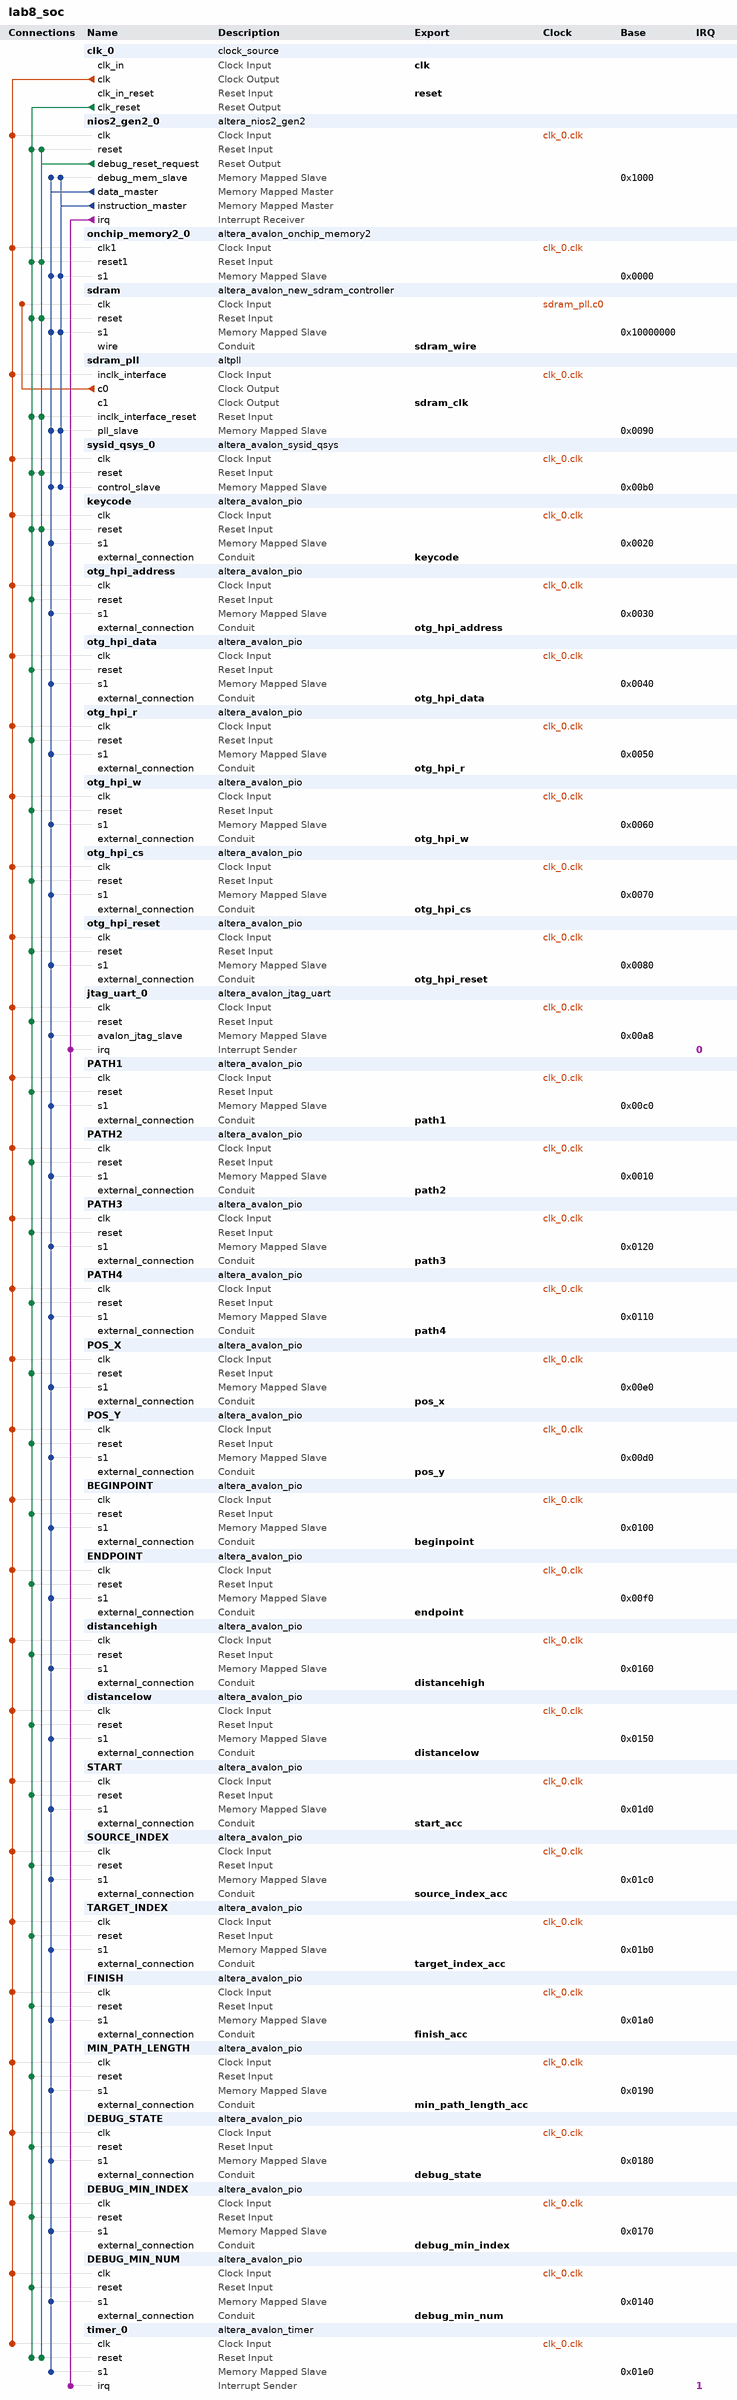
[diagram p0: system contents]
# Platform Designer (Qsys) system lab8_soc, Cyclone IV E EP4CE115F29C7
# Parameters at their usual value, and those the tool derives, are not listed.
package require -exact qsys 18.1
create_system lab8_soc
set_project_property DEVICE_FAMILY {Cyclone IV E}
set_project_property DEVICE EP4CE115F29C7

add_instance clk_0 clock_source 18.1
set_instance_parameter_value clk_0 clockFrequency 50000000

add_instance nios2_gen2_0 altera_nios2_gen2 18.1
set_instance_parameter_value nios2_gen2_0 dcache_size 2048
set_instance_parameter_value nios2_gen2_0 exceptionSlave sdram.s1
set_instance_parameter_value nios2_gen2_0 icache_size 4096
set_instance_parameter_value nios2_gen2_0 impl Tiny
set_instance_parameter_value nios2_gen2_0 resetSlave sdram.s1

add_instance onchip_memory2_0 altera_avalon_onchip_memory2 18.1
set_instance_parameter_value onchip_memory2_0 dataWidth 32
set_instance_parameter_value onchip_memory2_0 dualPort false
set_instance_parameter_value onchip_memory2_0 initMemContent true
set_instance_parameter_value onchip_memory2_0 initializationFileName onchip_mem.hex
set_instance_parameter_value onchip_memory2_0 memorySize 16

add_instance sdram altera_avalon_new_sdram_controller 18.1
set_instance_parameter_value sdram TAC 5.5
set_instance_parameter_value sdram TRCD 20.0
set_instance_parameter_value sdram TRP 20.0
set_instance_parameter_value sdram casLatency 3
set_instance_parameter_value sdram columnWidth 10
set_instance_parameter_value sdram dataWidth 32
set_instance_parameter_value sdram generateSimulationModel false
set_instance_parameter_value sdram model single_Micron_MT48LC4M32B2_7_chip
set_instance_parameter_value sdram numberOfBanks 4
set_instance_parameter_value sdram numberOfChipSelects 1
set_instance_parameter_value sdram powerUpDelay 200.0
set_instance_parameter_value sdram refreshPeriod 7.8125
set_instance_parameter_value sdram rowWidth 13

add_instance sdram_pll altpll 18.1
set_instance_parameter_value sdram_pll CLK0_DIVIDE_BY 1
set_instance_parameter_value sdram_pll CLK0_MULTIPLY_BY 1
set_instance_parameter_value sdram_pll CLK1_DIVIDE_BY 1
set_instance_parameter_value sdram_pll CLK1_DUTY_CYCLE 50
set_instance_parameter_value sdram_pll CLK1_MULTIPLY_BY 1
set_instance_parameter_value sdram_pll CLK1_PHASE_SHIFT -3000
set_instance_parameter_value sdram_pll INCLK0_INPUT_FREQUENCY 20000
set_instance_parameter_value sdram_pll PORT_ARESET PORT_UNUSED
set_instance_parameter_value sdram_pll PORT_LOCKED PORT_UNUSED
set_instance_parameter_value sdram_pll PORT_clk1 PORT_USED
set_instance_parameter_value sdram_pll PORT_clk2 PORT_UNUSED
set_instance_parameter_value sdram_pll PORT_clk3 PORT_UNUSED

add_instance sysid_qsys_0 altera_avalon_sysid_qsys 18.1
set_instance_parameter_value sysid_qsys_0 id 0

add_instance keycode altera_avalon_pio 18.1
set_instance_parameter_value keycode direction Output
set_instance_parameter_value keycode width 8

add_instance otg_hpi_address altera_avalon_pio 18.1
set_instance_parameter_value otg_hpi_address direction Output
set_instance_parameter_value otg_hpi_address width 2

add_instance otg_hpi_data altera_avalon_pio 18.1
set_instance_parameter_value otg_hpi_data direction InOut
set_instance_parameter_value otg_hpi_data width 16

add_instance otg_hpi_r altera_avalon_pio 18.1
set_instance_parameter_value otg_hpi_r direction Output
set_instance_parameter_value otg_hpi_r width 1

add_instance otg_hpi_w altera_avalon_pio 18.1
set_instance_parameter_value otg_hpi_w direction Output
set_instance_parameter_value otg_hpi_w width 1

add_instance otg_hpi_cs altera_avalon_pio 18.1
set_instance_parameter_value otg_hpi_cs direction Output
set_instance_parameter_value otg_hpi_cs width 1

add_instance otg_hpi_reset altera_avalon_pio 18.1
set_instance_parameter_value otg_hpi_reset direction Output
set_instance_parameter_value otg_hpi_reset width 1

add_instance jtag_uart_0 altera_avalon_jtag_uart 18.1
set_instance_parameter_value jtag_uart_0 simInteractiveOptions NO_INTERACTIVE_WINDOWS

add_instance PATH1 altera_avalon_pio 18.1
set_instance_parameter_value PATH1 direction Output
set_instance_parameter_value PATH1 width 32

add_instance PATH2 altera_avalon_pio 18.1
set_instance_parameter_value PATH2 direction Output
set_instance_parameter_value PATH2 width 32

add_instance PATH3 altera_avalon_pio 18.1
set_instance_parameter_value PATH3 direction Output
set_instance_parameter_value PATH3 width 32

add_instance PATH4 altera_avalon_pio 18.1
set_instance_parameter_value PATH4 direction Output
set_instance_parameter_value PATH4 width 32

add_instance POS_X altera_avalon_pio 18.1
set_instance_parameter_value POS_X direction Input
set_instance_parameter_value POS_X width 10

add_instance POS_Y altera_avalon_pio 18.1
set_instance_parameter_value POS_Y direction Input
set_instance_parameter_value POS_Y width 10

add_instance BEGINPOINT altera_avalon_pio 18.1
set_instance_parameter_value BEGINPOINT direction Output
set_instance_parameter_value BEGINPOINT width 32

add_instance ENDPOINT altera_avalon_pio 18.1
set_instance_parameter_value ENDPOINT direction Output
set_instance_parameter_value ENDPOINT width 32

add_instance distancehigh altera_avalon_pio 18.1
set_instance_parameter_value distancehigh direction Output
set_instance_parameter_value distancehigh width 32

add_instance distancelow altera_avalon_pio 18.1
set_instance_parameter_value distancelow direction Output
set_instance_parameter_value distancelow width 32

add_instance START altera_avalon_pio 18.1
set_instance_parameter_value START direction Output
set_instance_parameter_value START width 1

add_instance SOURCE_INDEX altera_avalon_pio 18.1
set_instance_parameter_value SOURCE_INDEX direction Output
set_instance_parameter_value SOURCE_INDEX width 8

add_instance TARGET_INDEX altera_avalon_pio 18.1
set_instance_parameter_value TARGET_INDEX direction Output
set_instance_parameter_value TARGET_INDEX width 8

add_instance FINISH altera_avalon_pio 18.1
set_instance_parameter_value FINISH direction Input
set_instance_parameter_value FINISH width 1

add_instance MIN_PATH_LENGTH altera_avalon_pio 18.1
set_instance_parameter_value MIN_PATH_LENGTH direction Input
set_instance_parameter_value MIN_PATH_LENGTH width 16

add_instance DEBUG_STATE altera_avalon_pio 18.1
set_instance_parameter_value DEBUG_STATE direction Input
set_instance_parameter_value DEBUG_STATE width 3

add_instance DEBUG_MIN_INDEX altera_avalon_pio 18.1
set_instance_parameter_value DEBUG_MIN_INDEX direction Input
set_instance_parameter_value DEBUG_MIN_INDEX width 7

add_instance DEBUG_MIN_NUM altera_avalon_pio 18.1
set_instance_parameter_value DEBUG_MIN_NUM direction Input
set_instance_parameter_value DEBUG_MIN_NUM width 16

add_instance timer_0 altera_avalon_timer 18.1
set_instance_parameter_value timer_0 period 1
set_instance_parameter_value timer_0 periodUnits MSEC

# connections
add_connection clk_0.clk BEGINPOINT.clk clock
add_connection clk_0.clk DEBUG_MIN_INDEX.clk clock
add_connection clk_0.clk DEBUG_MIN_NUM.clk clock
add_connection clk_0.clk DEBUG_STATE.clk clock
add_connection clk_0.clk distancehigh.clk clock
add_connection clk_0.clk distancelow.clk clock
add_connection clk_0.clk ENDPOINT.clk clock
add_connection clk_0.clk FINISH.clk clock
add_connection clk_0.clk jtag_uart_0.clk clock
add_connection clk_0.clk keycode.clk clock
add_connection clk_0.clk MIN_PATH_LENGTH.clk clock
add_connection clk_0.clk nios2_gen2_0.clk clock
add_connection clk_0.clk onchip_memory2_0.clk1 clock
add_connection clk_0.clk otg_hpi_address.clk clock
add_connection clk_0.clk otg_hpi_cs.clk clock
add_connection clk_0.clk otg_hpi_data.clk clock
add_connection clk_0.clk otg_hpi_r.clk clock
add_connection clk_0.clk otg_hpi_reset.clk clock
add_connection clk_0.clk otg_hpi_w.clk clock
add_connection clk_0.clk PATH1.clk clock
add_connection clk_0.clk PATH2.clk clock
add_connection clk_0.clk PATH3.clk clock
add_connection clk_0.clk PATH4.clk clock
add_connection clk_0.clk POS_X.clk clock
add_connection clk_0.clk POS_Y.clk clock
add_connection clk_0.clk sdram_pll.inclk_interface clock
add_connection clk_0.clk SOURCE_INDEX.clk clock
add_connection clk_0.clk START.clk clock
add_connection clk_0.clk sysid_qsys_0.clk clock
add_connection clk_0.clk TARGET_INDEX.clk clock
add_connection clk_0.clk timer_0.clk clock
add_connection sdram_pll.c0 sdram.clk clock
add_connection clk_0.clk_reset BEGINPOINT.reset reset
add_connection clk_0.clk_reset DEBUG_MIN_INDEX.reset reset
add_connection clk_0.clk_reset DEBUG_MIN_NUM.reset reset
add_connection clk_0.clk_reset DEBUG_STATE.reset reset
add_connection clk_0.clk_reset distancehigh.reset reset
add_connection clk_0.clk_reset distancelow.reset reset
add_connection clk_0.clk_reset ENDPOINT.reset reset
add_connection clk_0.clk_reset FINISH.reset reset
add_connection clk_0.clk_reset jtag_uart_0.reset reset
add_connection clk_0.clk_reset keycode.reset reset
add_connection clk_0.clk_reset MIN_PATH_LENGTH.reset reset
add_connection clk_0.clk_reset nios2_gen2_0.reset reset
add_connection clk_0.clk_reset onchip_memory2_0.reset1 reset
add_connection clk_0.clk_reset otg_hpi_address.reset reset
add_connection clk_0.clk_reset otg_hpi_cs.reset reset
add_connection clk_0.clk_reset otg_hpi_data.reset reset
add_connection clk_0.clk_reset otg_hpi_r.reset reset
add_connection clk_0.clk_reset otg_hpi_reset.reset reset
add_connection clk_0.clk_reset otg_hpi_w.reset reset
add_connection clk_0.clk_reset PATH1.reset reset
add_connection clk_0.clk_reset PATH2.reset reset
add_connection clk_0.clk_reset PATH3.reset reset
add_connection clk_0.clk_reset PATH4.reset reset
add_connection clk_0.clk_reset POS_X.reset reset
add_connection clk_0.clk_reset POS_Y.reset reset
add_connection clk_0.clk_reset sdram.reset reset
add_connection clk_0.clk_reset sdram_pll.inclk_interface_reset reset
add_connection clk_0.clk_reset SOURCE_INDEX.reset reset
add_connection clk_0.clk_reset START.reset reset
add_connection clk_0.clk_reset sysid_qsys_0.reset reset
add_connection clk_0.clk_reset TARGET_INDEX.reset reset
add_connection clk_0.clk_reset timer_0.reset reset
add_connection nios2_gen2_0.debug_reset_request keycode.reset reset
add_connection nios2_gen2_0.debug_reset_request nios2_gen2_0.reset reset
add_connection nios2_gen2_0.debug_reset_request onchip_memory2_0.reset1 reset
add_connection nios2_gen2_0.debug_reset_request sdram.reset reset
add_connection nios2_gen2_0.debug_reset_request sdram_pll.inclk_interface_reset reset
add_connection nios2_gen2_0.debug_reset_request sysid_qsys_0.reset reset
add_connection nios2_gen2_0.debug_reset_request timer_0.reset reset
add_connection nios2_gen2_0.data_master BEGINPOINT.s1 avalon
set_connection_parameter_value nios2_gen2_0.data_master/BEGINPOINT.s1 baseAddress 0x0100
add_connection nios2_gen2_0.data_master DEBUG_MIN_INDEX.s1 avalon
set_connection_parameter_value nios2_gen2_0.data_master/DEBUG_MIN_INDEX.s1 baseAddress 0x0170
add_connection nios2_gen2_0.data_master DEBUG_MIN_NUM.s1 avalon
set_connection_parameter_value nios2_gen2_0.data_master/DEBUG_MIN_NUM.s1 baseAddress 0x0140
add_connection nios2_gen2_0.data_master DEBUG_STATE.s1 avalon
set_connection_parameter_value nios2_gen2_0.data_master/DEBUG_STATE.s1 baseAddress 0x0180
add_connection nios2_gen2_0.data_master distancehigh.s1 avalon
set_connection_parameter_value nios2_gen2_0.data_master/distancehigh.s1 baseAddress 0x0160
add_connection nios2_gen2_0.data_master distancelow.s1 avalon
set_connection_parameter_value nios2_gen2_0.data_master/distancelow.s1 baseAddress 0x0150
add_connection nios2_gen2_0.data_master ENDPOINT.s1 avalon
set_connection_parameter_value nios2_gen2_0.data_master/ENDPOINT.s1 baseAddress 0x00f0
add_connection nios2_gen2_0.data_master FINISH.s1 avalon
set_connection_parameter_value nios2_gen2_0.data_master/FINISH.s1 baseAddress 0x01a0
add_connection nios2_gen2_0.data_master jtag_uart_0.avalon_jtag_slave avalon
set_connection_parameter_value nios2_gen2_0.data_master/jtag_uart_0.avalon_jtag_slave baseAddress 0x00a8
add_connection nios2_gen2_0.data_master keycode.s1 avalon
set_connection_parameter_value nios2_gen2_0.data_master/keycode.s1 baseAddress 0x0020
add_connection nios2_gen2_0.data_master MIN_PATH_LENGTH.s1 avalon
set_connection_parameter_value nios2_gen2_0.data_master/MIN_PATH_LENGTH.s1 baseAddress 0x0190
add_connection nios2_gen2_0.data_master nios2_gen2_0.debug_mem_slave avalon
set_connection_parameter_value nios2_gen2_0.data_master/nios2_gen2_0.debug_mem_slave baseAddress 0x1000
add_connection nios2_gen2_0.data_master onchip_memory2_0.s1 avalon
set_connection_parameter_value nios2_gen2_0.data_master/onchip_memory2_0.s1 baseAddress 0x0000
add_connection nios2_gen2_0.data_master otg_hpi_address.s1 avalon
set_connection_parameter_value nios2_gen2_0.data_master/otg_hpi_address.s1 baseAddress 0x0030
add_connection nios2_gen2_0.data_master otg_hpi_cs.s1 avalon
set_connection_parameter_value nios2_gen2_0.data_master/otg_hpi_cs.s1 baseAddress 0x0070
add_connection nios2_gen2_0.data_master otg_hpi_data.s1 avalon
set_connection_parameter_value nios2_gen2_0.data_master/otg_hpi_data.s1 baseAddress 0x0040
add_connection nios2_gen2_0.data_master otg_hpi_r.s1 avalon
set_connection_parameter_value nios2_gen2_0.data_master/otg_hpi_r.s1 baseAddress 0x0050
add_connection nios2_gen2_0.data_master otg_hpi_reset.s1 avalon
set_connection_parameter_value nios2_gen2_0.data_master/otg_hpi_reset.s1 baseAddress 0x0080
add_connection nios2_gen2_0.data_master otg_hpi_w.s1 avalon
set_connection_parameter_value nios2_gen2_0.data_master/otg_hpi_w.s1 baseAddress 0x0060
add_connection nios2_gen2_0.data_master PATH1.s1 avalon
set_connection_parameter_value nios2_gen2_0.data_master/PATH1.s1 baseAddress 0x00c0
add_connection nios2_gen2_0.data_master PATH2.s1 avalon
set_connection_parameter_value nios2_gen2_0.data_master/PATH2.s1 baseAddress 0x0010
add_connection nios2_gen2_0.data_master PATH3.s1 avalon
set_connection_parameter_value nios2_gen2_0.data_master/PATH3.s1 baseAddress 0x0120
add_connection nios2_gen2_0.data_master PATH4.s1 avalon
set_connection_parameter_value nios2_gen2_0.data_master/PATH4.s1 baseAddress 0x0110
add_connection nios2_gen2_0.data_master POS_X.s1 avalon
set_connection_parameter_value nios2_gen2_0.data_master/POS_X.s1 baseAddress 0x00e0
add_connection nios2_gen2_0.data_master POS_Y.s1 avalon
set_connection_parameter_value nios2_gen2_0.data_master/POS_Y.s1 baseAddress 0x00d0
add_connection nios2_gen2_0.data_master sdram.s1 avalon
set_connection_parameter_value nios2_gen2_0.data_master/sdram.s1 baseAddress 0x10000000
add_connection nios2_gen2_0.data_master sdram_pll.pll_slave avalon
set_connection_parameter_value nios2_gen2_0.data_master/sdram_pll.pll_slave baseAddress 0x0090
add_connection nios2_gen2_0.data_master SOURCE_INDEX.s1 avalon
set_connection_parameter_value nios2_gen2_0.data_master/SOURCE_INDEX.s1 baseAddress 0x01c0
add_connection nios2_gen2_0.data_master START.s1 avalon
set_connection_parameter_value nios2_gen2_0.data_master/START.s1 baseAddress 0x01d0
add_connection nios2_gen2_0.data_master sysid_qsys_0.control_slave avalon
set_connection_parameter_value nios2_gen2_0.data_master/sysid_qsys_0.control_slave baseAddress 0x00b0
add_connection nios2_gen2_0.data_master TARGET_INDEX.s1 avalon
set_connection_parameter_value nios2_gen2_0.data_master/TARGET_INDEX.s1 baseAddress 0x01b0
add_connection nios2_gen2_0.data_master timer_0.s1 avalon
set_connection_parameter_value nios2_gen2_0.data_master/timer_0.s1 baseAddress 0x01e0
add_connection nios2_gen2_0.instruction_master nios2_gen2_0.debug_mem_slave avalon
set_connection_parameter_value nios2_gen2_0.instruction_master/nios2_gen2_0.debug_mem_slave baseAddress 0x1000
add_connection nios2_gen2_0.instruction_master onchip_memory2_0.s1 avalon
set_connection_parameter_value nios2_gen2_0.instruction_master/onchip_memory2_0.s1 baseAddress 0x0000
add_connection nios2_gen2_0.instruction_master sdram.s1 avalon
set_connection_parameter_value nios2_gen2_0.instruction_master/sdram.s1 baseAddress 0x10000000
add_connection nios2_gen2_0.instruction_master sdram_pll.pll_slave avalon
set_connection_parameter_value nios2_gen2_0.instruction_master/sdram_pll.pll_slave baseAddress 0x0090
add_connection nios2_gen2_0.instruction_master sysid_qsys_0.control_slave avalon
set_connection_parameter_value nios2_gen2_0.instruction_master/sysid_qsys_0.control_slave baseAddress 0x00b0
add_connection nios2_gen2_0.irq jtag_uart_0.irq interrupt
set_connection_parameter_value nios2_gen2_0.irq/jtag_uart_0.irq irqNumber 0
add_connection nios2_gen2_0.irq timer_0.irq interrupt
set_connection_parameter_value nios2_gen2_0.irq/timer_0.irq irqNumber 1

# exported interfaces
add_interface beginpoint conduit end
set_interface_property beginpoint EXPORT_OF BEGINPOINT.external_connection
add_interface clk clock sink
set_interface_property clk EXPORT_OF clk_0.clk_in
add_interface debug_min_index conduit end
set_interface_property debug_min_index EXPORT_OF DEBUG_MIN_INDEX.external_connection
add_interface debug_min_num conduit end
set_interface_property debug_min_num EXPORT_OF DEBUG_MIN_NUM.external_connection
add_interface debug_state conduit end
set_interface_property debug_state EXPORT_OF DEBUG_STATE.external_connection
add_interface distancehigh conduit end
set_interface_property distancehigh EXPORT_OF distancehigh.external_connection
add_interface distancelow conduit end
set_interface_property distancelow EXPORT_OF distancelow.external_connection
add_interface endpoint conduit end
set_interface_property endpoint EXPORT_OF ENDPOINT.external_connection
add_interface finish_acc conduit end
set_interface_property finish_acc EXPORT_OF FINISH.external_connection
add_interface keycode conduit end
set_interface_property keycode EXPORT_OF keycode.external_connection
add_interface min_path_length_acc conduit end
set_interface_property min_path_length_acc EXPORT_OF MIN_PATH_LENGTH.external_connection
add_interface otg_hpi_address conduit end
set_interface_property otg_hpi_address EXPORT_OF otg_hpi_address.external_connection
add_interface otg_hpi_cs conduit end
set_interface_property otg_hpi_cs EXPORT_OF otg_hpi_cs.external_connection
add_interface otg_hpi_data conduit end
set_interface_property otg_hpi_data EXPORT_OF otg_hpi_data.external_connection
add_interface otg_hpi_r conduit end
set_interface_property otg_hpi_r EXPORT_OF otg_hpi_r.external_connection
add_interface otg_hpi_reset conduit end
set_interface_property otg_hpi_reset EXPORT_OF otg_hpi_reset.external_connection
add_interface otg_hpi_w conduit end
set_interface_property otg_hpi_w EXPORT_OF otg_hpi_w.external_connection
add_interface path1 conduit end
set_interface_property path1 EXPORT_OF PATH1.external_connection
add_interface path2 conduit end
set_interface_property path2 EXPORT_OF PATH2.external_connection
add_interface path3 conduit end
set_interface_property path3 EXPORT_OF PATH3.external_connection
add_interface path4 conduit end
set_interface_property path4 EXPORT_OF PATH4.external_connection
add_interface pos_x conduit end
set_interface_property pos_x EXPORT_OF POS_X.external_connection
add_interface pos_y conduit end
set_interface_property pos_y EXPORT_OF POS_Y.external_connection
add_interface reset reset sink
set_interface_property reset EXPORT_OF clk_0.clk_in_reset
add_interface sdram_clk clock source
set_interface_property sdram_clk EXPORT_OF sdram_pll.c1
add_interface sdram_wire conduit end
set_interface_property sdram_wire EXPORT_OF sdram.wire
add_interface source_index_acc conduit end
set_interface_property source_index_acc EXPORT_OF SOURCE_INDEX.external_connection
add_interface start_acc conduit end
set_interface_property start_acc EXPORT_OF START.external_connection
add_interface target_index_acc conduit end
set_interface_property target_index_acc EXPORT_OF TARGET_INDEX.external_connection

set_interconnect_requirement {$system} qsys_mm.clockCrossingAdapter HANDSHAKE
set_interconnect_requirement {$system} qsys_mm.enableEccProtection FALSE
set_interconnect_requirement {$system} qsys_mm.insertDefaultSlave FALSE
set_interconnect_requirement {$system} qsys_mm.maxAdditionalLatency 1

save_system lab8_soc.qsys
